# EAGLE design PM2016 (EAGLE 7.6.0)
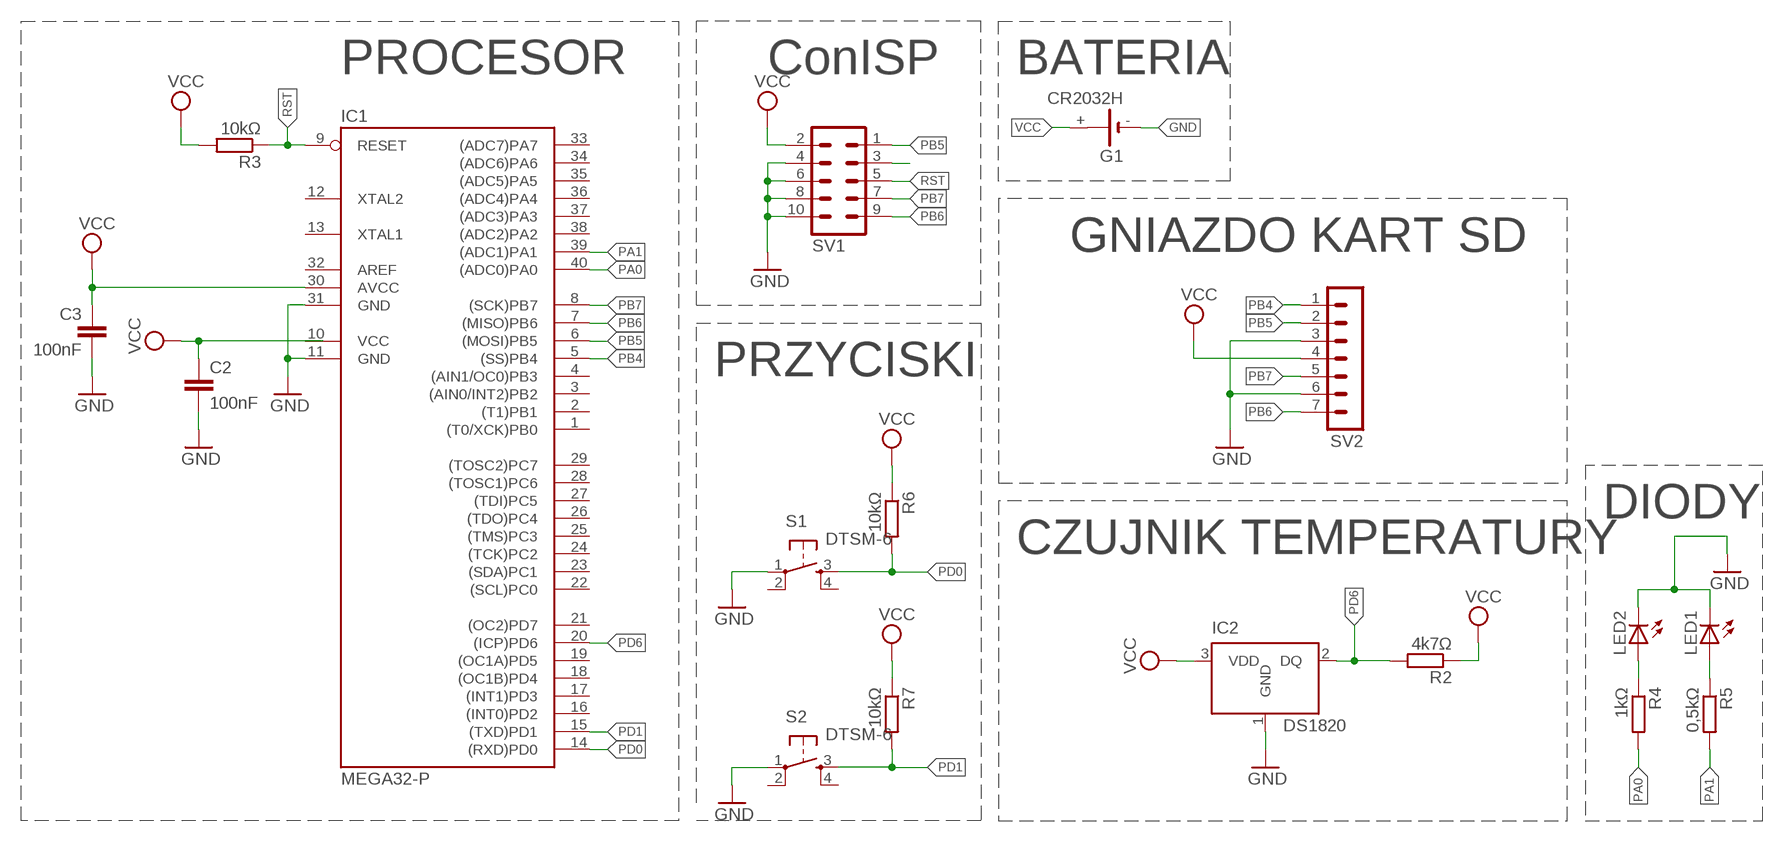
[diagram p0: schematic, sheet 1]

## Parts
C2  100nF  C-EU050-025X075  [C050-025X075]
C3  100nF  C-EU050-025X075  [C050-025X075]
G1  CR2032H  [CR2032H]
IC1  MEGA32-P  [DIL40]
IC2  DS1820  [TO-92]
LED1  LED5MM  [LED5MM]
LED2  LED5MM  [LED5MM]
R2  4k7Ω  R-EU_0204/5  [0204/5]
R3  10kΩ  R-EU_0204/5  [0204/5]
R4  1kΩ  R-EU_0204/5  [0204/5]
R5  0,5kΩ  R-EU_0204/5  [0204/5]
R6  10kΩ  R-EU_0204/5  [0204/5]
R7  10kΩ  R-EU_0204/5  [0204/5]
S1  DTSM-6  [DTSM-6]
S2  DTSM-6  [DTSM-6]
SV1  ML10  [ML10]
SV2  MA07-1  [MA07-1]

## Nets
GND: C2.2 C3.2 G1.- IC1.11(GND) IC1.31(GND) IC2.1(GND) LED1.K(C) LED2.K(C) S1.1 S2.1 SV1.4 SV1.6 SV1.8 SV1.10 SV2.3 SV2.6
N$1: SV1.3
N$4: LED2.A R4.1
N$5: LED1.A R5.1
PA0: IC1.40((ADC0)PA0) R4.2
PA1: IC1.39((ADC1)PA1) R5.2
PB4: IC1.5((SS)PB4) SV2.1
PB5: IC1.6((MOSI)PB5) SV1.1 SV2.2
PB6: IC1.7((MISO)PB6) SV1.9 SV2.7
PB7: IC1.8((SCK)PB7) SV1.7 SV2.5
PD0: IC1.14((RXD)PD0) R6.2 S1.3
PD1: IC1.15((TXD)PD1) R7.2 S2.3
PD6: IC1.20((ICP)PD6) IC2.2(DQ) R2.2
RST: IC1.9(RESET) R3.1 SV1.5
VCC: C2.1 C3.1 G1.+ IC1.30(AVCC) IC2.3(VDD) R2.1 R3.2 R6.1 R7.1 SV1.2 SV2.4
Unconnected: G1.+@1(+) IC1.1((T0/XCK)PB0) IC1.2((T1)PB1) IC1.3((AIN0/INT2)PB2) IC1.4((AIN1/OC0)PB3) IC1.12(XTAL2) IC1.13(XTAL1) IC1.16((INT0)PD2) IC1.17((INT1)PD3) IC1.18((OC1B)PD4) IC1.19((OC1A)PD5) IC1.21((OC2)PD7) IC1.22((SCL)PC0) IC1.23((SDA)PC1) IC1.24((TCK)PC2) IC1.25((TMS)PC3) IC1.26((TDO)PC4) IC1.27((TDI)PC5) IC1.28((TOSC1)PC6) IC1.29((TOSC2)PC7) IC1.32(AREF) IC1.33((ADC7)PA7) IC1.34((ADC6)PA6) IC1.35((ADC5)PA5) IC1.36((ADC4)PA4) IC1.37((ADC3)PA3) IC1.38((ADC2)PA2) S1.2 S1.4 S2.2 S2.4

## Notes on the sheet
- PROCESOR | ConISP | BATERIA
- GNIAZDO KART SD
- PRZYCISKI
- DIODY
- CZUJNIK TEMPERATURY

## Power pins joined to a net without a drawn wire
VCC: IC1.10(VCC)

## Library data of the parts
C2 C3 = rcl:C-EU: CAPACITOR, European symbol
G1 = battery:CR2032H: LI BATTERY Varta
IC1 = atmel:MEGA32-P: MICROCONTROLLER 32 Kbytes FLASH 2 Kbytes SRAM 1 Kbytes EEPROM USART 8-channel 10 bit ADC Source: www.atmel.com .. doc2503.pdf; MPN: ATMEGA32-16PU; OC_FARNELL: 1661729; OC_NEWARK: 51P1794
IC2 = DS1820:DS1820: DS1820 - 1-Wire Digital Thermometer
LED1 LED2 = led:LED: LED OSRAM: - CHIPLED LG R971, LG N971, LY N971, LG Q971, LY Q971, LO R971, LY R971 LH N974, LH R974 LS Q976, LO Q976, LY Q976 LO Q996 - Hyper CHIPLED LW Q18S LB Q993, LB Q99A, LB R99A - SideLED LS A670, LO A670, LY A670, LG A670, LP A670 LB A673, LV A673, LT A673, LW A673 LH A674 LY A675 LS A676, LA A676, LO A676, LY A676, LW A676 LS A679, LY A679, LG A679 - Hyper Micro SIDELED® LS Y876, LA Y876, LO Y876, LY Y876 LT Y87S - SmartLED LW L88C, LW L88S LB L89C, LB L89S, LG L890 LS L89K, LO L89K, LY L89K LS L896, LA L896, LO L896, LY L896 - TOPLED LS T670, LO T670, LY T670, LG T670, LP T670 LSG T670, LSP T670, LSY T670, LOP T670, LYG T670 LG T671, LOG T671, LSG T671 LB T673, LV T673, LT T673, LW T673 LH T674 LS T676, LA T676, LO T676, LY T676, LB T676, LH T676, LSB T676, LW T676 LB T67C, LV T67C, LT T67C, LS T67K, LO T67K, LY T67K, LW E67C LS E67B, LA E67B, LO E67B, LY E67B, LB E67C, LV E67C, LT E67C LW T67C LS T679, LY T679, LG T679 LS T770, LO T770, LY T770, LG T770, LP T770 LB T773, LV T773, LT T773, LW T773 LH T774 LS E675, LA E675, LY E675, LS T675 LS T776, LA T776, LO T776, LY T776, LB T776 LHGB T686 LT T68C, LB T68C - Hyper Mini TOPLED® LB M676 - Mini TOPLED Santana® LG M470 LS M47K, LO M47K, LY M47K Source: http://www.osram.convergy.de LUXEON: - LUMILED® LXK2-PW12-R00, LXK2-PW12-S00, LXK2-PW14-U00, LXK2-PW14-V00 LXK2-PM12-R00, LXK2-PM12-S00, LXK2-PM14-U00 LXK2-PE12-Q00, LXK2-PE12-R00, LXK2-PE12-S00, LXK2-PE14-T00, LXK2-PE14-U00 LXK2-PB12-K00, LXK2-PB12-L00, LXK2-PB12-M00, LXK2-PB14-N00, LXK2-PB14-P00, LXK2-PB14-Q00 LXK2-PR12-L00, LXK2-PR12-M00, LXK2-PR14-Q00, LXK2-PR14-R00 LXK2-PD12-Q00, LXK2-PD12-R00, LXK2-PD12-S00 LXK2-PH12-R00, LXK2-PH12-S00 LXK2-PL12-P00, LXK2-PL12-Q00, LXK2-PL12-R00 Source: www.luxeon.com KINGBRIGHT: KA-3528ASYC Source: www.kingbright.com
R2-R7 = rcl:R-EU_: RESISTOR, European symbol
S1 S2 = switch-tact:DTSM-6
SV1 = con-ml:ML10: HARTING; OC_FARNELL: unknown; OC_NEWARK: unknown
SV2 = con-lstb:MA07-1: PIN HEADER; OC_FARNELL: unknown; OC_NEWARK: unknown

## Board
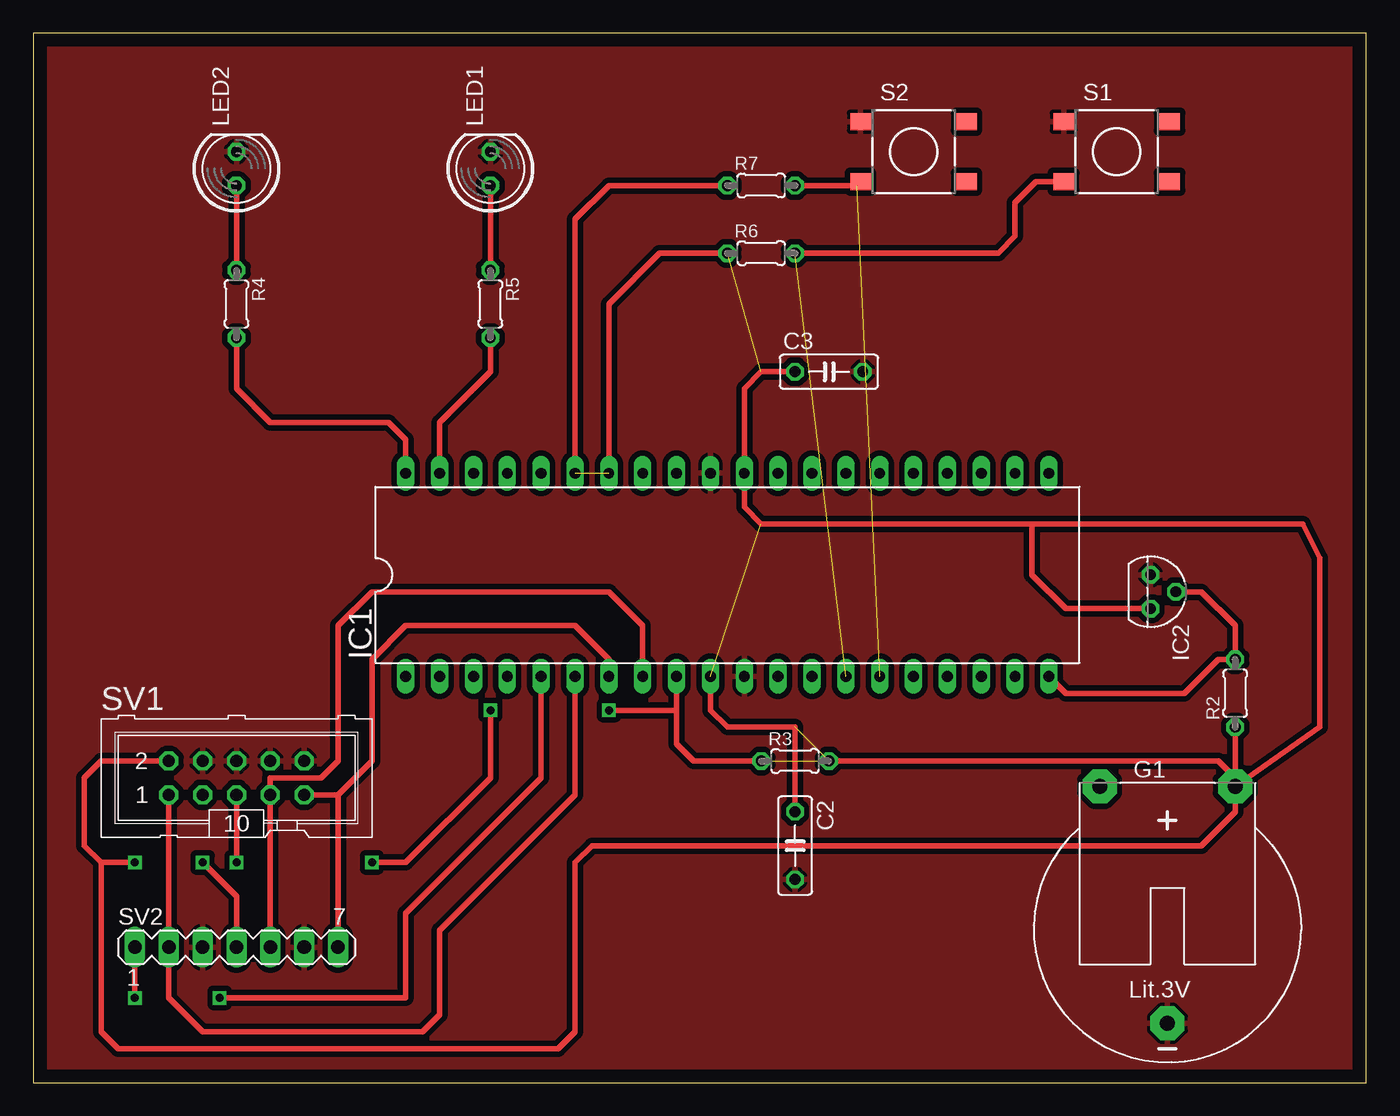
[diagram p1: board, top side]
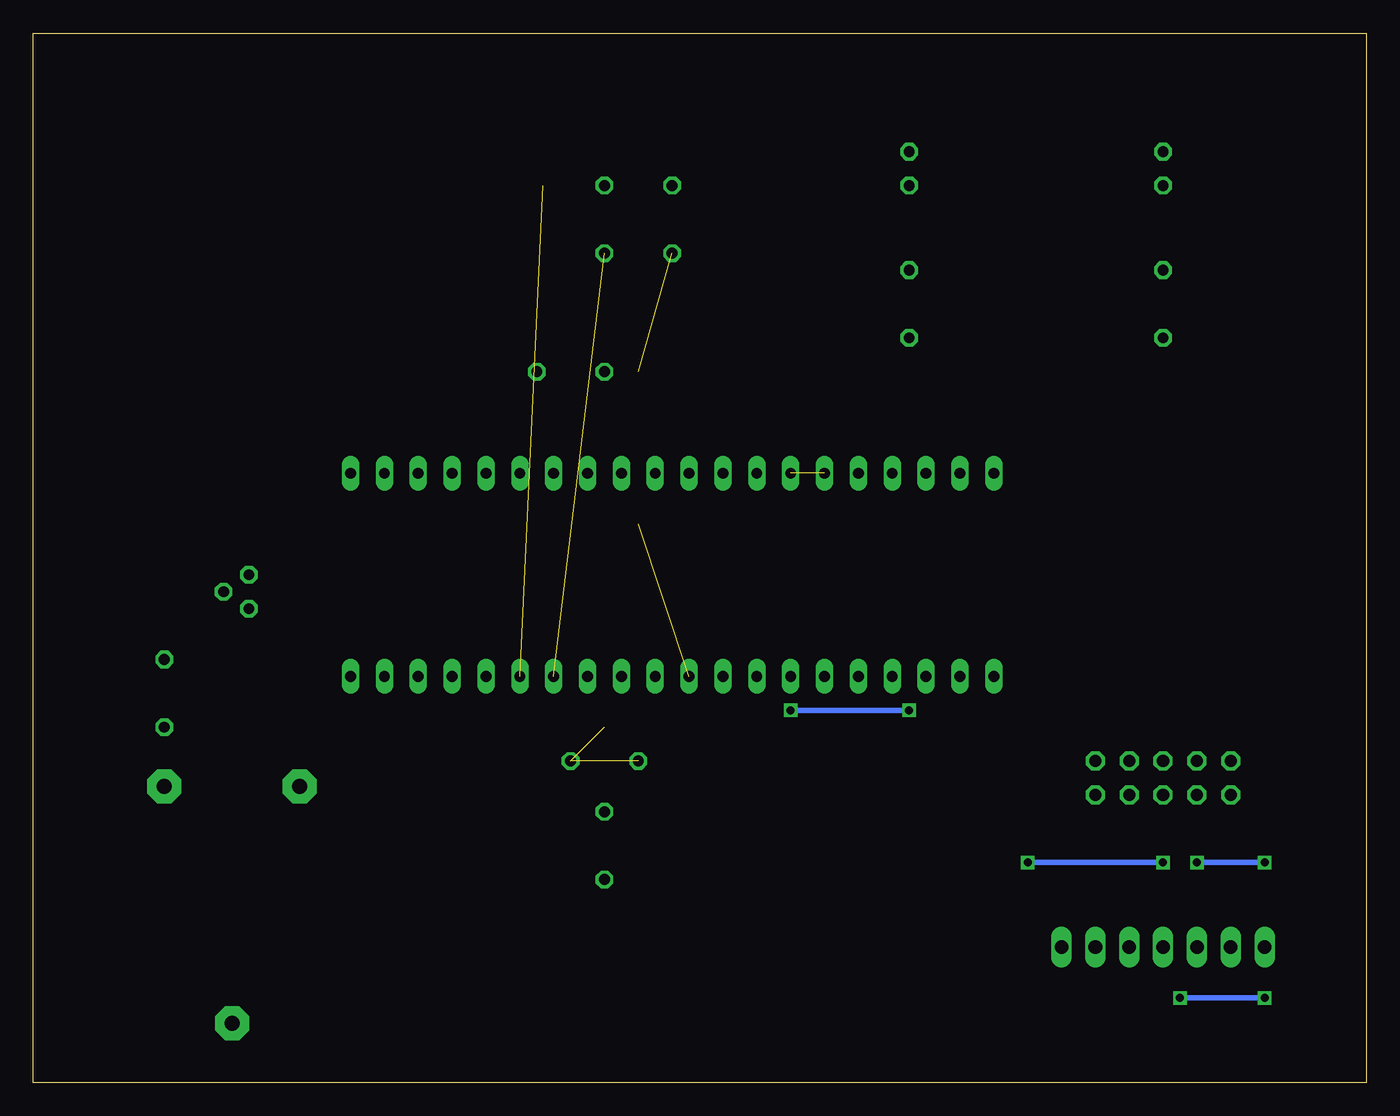
[diagram p2: board, bottom side, seen from below]

Size 100 x 78.73 mm. Coordinates in mm from the lower left corner, seen from the top.
Outline: 0,0 100,0 100,78.73 0,78.73 0,0
Copper layers (1*16): Top 0.035mm / dielectric 1.5mm / Bottom 0.035mm
Design rules "default": minimum track width 10mil, minimum drill 24mil, track to track 8mil, track to pad 8mil, pad to pad 8mil, via to via 8mil, smd to smd 8mil, copper to edge 40mil, drill to drill 8mil, minimum pad ring 10mil, minimum via ring 8mil, stop-mask expansion 4mil, vias tented up to drill 0mil, thermal gap 10mil

### Footprints (pad centres in the part's own frame; a part is rotated, then mirrored left to right if it is on the bottom)
C050-025X075 = drill 0.813 octagon: 1 -2.54,0; 2 2.54,0
CR2032H = drill 1.118 pad 2.54 octagon: + 5.08,10.795; +@1 -5.08,10.795; - 0,-6.985
DIL40 = drill 0.813 long: 1 -24.13,-7.62; 2 -21.59,-7.62; 3 -19.05,-7.62; 4 -16.51,-7.62; 5 -13.97,-7.62; 6 -11.43,-7.62; 7 -8.89,-7.62; 8 -6.35,-7.62; 9 -3.81,-7.62; 10 -1.27,-7.62; 11 1.27,-7.62; 12 3.81,-7.62; 13 6.35,-7.62; 14 8.89,-7.62; 15 11.43,-7.62; 16 13.97,-7.62; 17 16.51,-7.62; 18 19.05,-7.62; 19 21.59,-7.62; 20 24.13,-7.62; 21 24.13,7.62; 22 21.59,7.62; 23 19.05,7.62; 24 16.51,7.62; 25 13.97,7.62; 26 11.43,7.62; 27 8.89,7.62; 28 6.35,7.62; 29 3.81,7.62; 30 1.27,7.62; 31 -1.27,7.62; 32 -3.81,7.62; 33 -6.35,7.62; 34 -8.89,7.62; 35 -11.43,7.62; 36 -13.97,7.62; 37 -16.51,7.62; 38 -19.05,7.62; 39 -21.59,7.62; 40 -24.13,7.62
TO-92 = drill 0.813 pad 1.27 octagon: 1 -1.27,0; 2 0,1.905; 3 1.27,0
LED5MM = drill 0.813 octagon: A -1.27,0; K 1.27,0
0204/5 = drill 0.813 octagon: 1 -2.54,0; 2 2.54,0
DTSM-6 = smd 1.55 x 1.3: 1 -3.975,2.25; 2 3.975,2.25; 3 -3.975,-2.25; 4 3.975,-2.25
ML10 = drill 0.914 octagon: 1 -5.08,-1.27; 2 -5.08,1.27; 3 -2.54,-1.27; 4 -2.54,1.27; 5 0,-1.27; 6 0,1.27; 7 2.54,-1.27; 8 2.54,1.27; 9 5.08,-1.27; 10 5.08,1.27
MA07-1 = drill 1.016 long: 1 -7.62,0; 2 -5.08,0; 3 -2.54,0; 4 0,0; 5 2.54,0; 6 5.08,0; 7 7.62,0

### Placement (x,y rotation side)
C2  57.15,17.78 270 top
C3  59.69,53.34 0 top
G1  85.09,11.43 0 top
IC1  52.07,38.1 0 top
IC2  83.82,36.83 270 top
LED1  34.29,68.58 90 top
LED2  15.24,68.58 90 top
R2  90.17,29.21 90 top
R3  57.15,24.13 0 top
R4  15.24,58.42 270 top
R5  34.29,58.42 270 top
R6  54.61,62.23 0 top
R7  54.61,67.31 0 top
S1  81.28,69.85 0 top
S2  66.04,69.85 0 top
SV1  15.24,22.86 0 top
SV2  15.24,10.16 0 top

### Tracks (layer width: path | path; a pad name or v marks a point on that pad's centre or on a via)
GND
  pour Top (isolate 0.406): -2.54,-2.54 101.6,-2.54 101.6,80.01 -2.54,80.01
N$4
  Top 0.406: LED2.A R4.1
N$5
  Top 0.406: LED1.A R5.1
PA0
  Top 0.406: R4.2 15.24,52.07 17.78,49.53 26.67,49.53 27.94,48.26 IC1.40
PA1
  Top 0.406: IC1.39 30.48,49.53 34.29,53.34 R5.2
PB4  (via drill 0.6)
  Top 0.406: IC1.5 38.1,22.86 27.94,12.7 27.94,6.35 v13.97,6.35 | v7.62,6.35 SV2.1
  Bottom 0.406: v13.97,6.35 v7.62,6.35
PB5
  Top 0.406: IC1.6 40.64,21.59 30.48,11.43 30.48,5.08 29.21,3.81 12.7,3.81 10.16,6.35 SV2.2 SV1.1
PB6
  Top 0.406: SV1.9 22.86,21.59 | 22.86,21.59 25.4,24.13 25.4,31.75 27.94,34.29 40.64,34.29 43.18,31.75 IC1.7 | SV2.7 22.86,21.59
PB7
  Top 0.406: SV2.5 SV1.7 17.78,22.86 21.59,22.86 22.86,24.13 22.86,34.29 25.4,36.83 43.18,36.83 45.72,34.29 IC1.8
PD0  (1 unrouted)
  Top 0.406: R6.2 72.39,62.23 73.66,63.5 73.66,66.04 75.22,67.6 S1.3
PD1  (1 unrouted)
  Top 0.406: S2.3 61.77,67.31 R7.2
PD6
  Top 0.406: IC2.2 87.63,36.83 90.17,34.29 R2.2 88.9,31.75 86.36,29.21 77.47,29.21 IC1.20
RST  (via drill 0.6)  (1 unrouted)
  Top 0.406: SV1.5 v15.24,16.51 | v25.4,16.51 27.94,16.51 34.29,22.86 v34.29,27.94 | v43.18,27.94 48.26,27.94 | 48.26,27.94 48.26,25.4 49.53,24.13 R3.1 | IC1.9 48.26,27.94 | 90.17,21.59 90.17,22.86 88.9,24.13 59.69,24.13
  Bottom 0.406: v15.24,16.51 v25.4,16.51 | v34.29,27.94 v43.18,27.94
VCC  (via drill 0.6)  (4 unrouted)
  Top 0.406: IC1.10 50.8,27.94 52.07,26.67 57.15,26.67 C2.1 | C3.1 54.61,53.34 53.34,52.07 IC1.30 53.34,43.18 54.61,41.91 74.93,41.91 | 74.93,41.91 95.25,41.91 96.52,39.37 96.52,26.67 G1.+ | SV1.2 5.08,24.13 3.81,22.86 3.81,17.78 5.08,16.51 | G1.+ 90.17,20.32 87.63,17.78 41.91,17.78 40.64,16.51 40.64,3.81 39.37,2.54 6.35,2.54 5.08,3.81 5.08,16.51 | SV2.4 15.24,13.97 v12.7,16.51 | v7.62,16.51 5.08,16.51 | R2.1 G1.+ | IC2.3 77.47,35.56 74.93,38.1 74.93,41.91 | R7.1 43.18,67.31 40.64,64.77 40.64,45.72 | R6.1 46.99,62.23 43.18,58.42 43.18,45.72
  Bottom 0.406: v12.7,16.51 v7.62,16.51